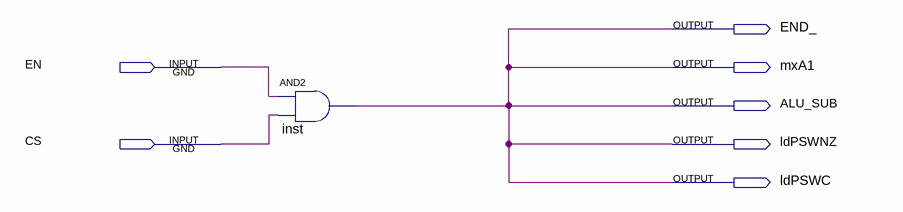
[diagram p0: schematic sheet]
// Quartus schematic CPX.bdf as structural Verilog: 1 symbols, 7 pins
module CPX (
  input  EN,
  input  CS,
  output END_,
  output mxA1,
  output ALU_SUB,
  output ldPSWNZ,
  output ldPSWC
);

  and inst (ALU_SUB, EN, CS);

  assign END_ = ALU_SUB;
  assign ldPSWC = ALU_SUB;
  assign ldPSWNZ = ALU_SUB;
  assign mxA1 = ALU_SUB;
endmodule
